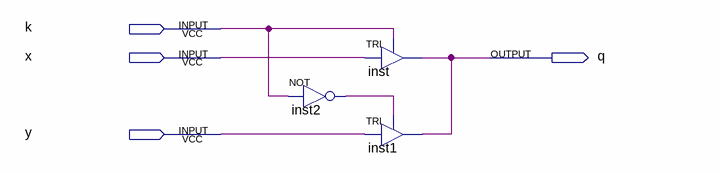
[diagram p0: schematic sheet]
// Quartus schematic xz3.bdf as structural Verilog: 3 symbols, 4 pins
module xz3 (
  input  k,
  input  x,
  input  y,
  output q
);

  wire inst2_out;

  not inst2 (inst2_out, k);
  TRI inst (.IN(x), .OE(k), .OUT(q));
  TRI inst1 (.IN(y), .OE(inst2_out), .OUT(q));
endmodule
